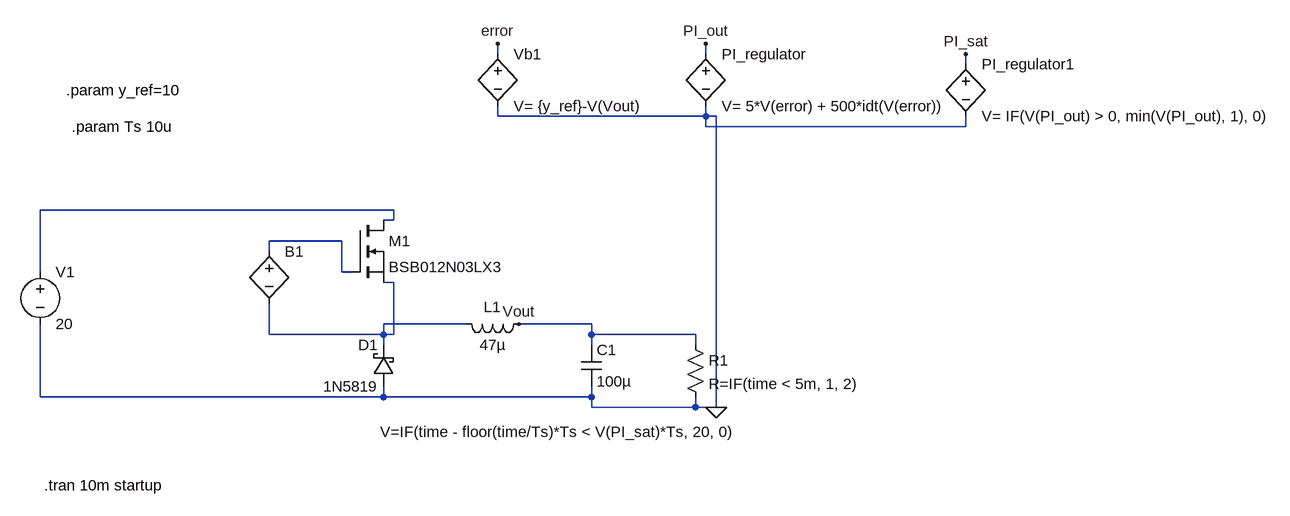
[diagram p0: schematic Buck-converter-closed-loop-control.asc]
Buck-converter-closed-loop-control.asc, the LTspice schematic file:
Version 4.1
SHEET 1 1948 680
WIRE 768 192 768 208
WIRE 448 192 448 208
WIRE 944 -240 944 -224
WIRE 1344 -224 1344 -208
WIRE 928 208 928 224
WIRE -80 96 -80 112
WIRE 624 -240 624 -224
WIRE 768 208 768 224
WIRE 768 224 928 224
WIRE 768 208 448 208
WIRE 928 224 960 224
WIRE 960 224 960 -224
WIRE 960 -224 944 -224
WIRE 944 -224 624 -224
WIRE 944 -224 944 -208
WIRE 944 -208 1344 -208
WIRE 448 208 -80 208
WIRE -80 208 -80 112
FLAG 960 224 0
WIRE 448 -64 464 -64
WIRE -80 16 -80 0
WIRE 464 -64 464 -80
WIRE 464 -80 -80 -80
WIRE -80 -80 -80 0
WIRE 272 -16 272 -32
WIRE 400 16 384 16
WIRE 272 -32 384 -32
WIRE 384 -32 384 16
WIRE 272 64 272 80
WIRE 448 128 448 112
WIRE 576 96 560 96
WIRE 448 32 464 32
WIRE 272 80 272 112
WIRE 272 112 448 112
WIRE 448 112 464 112
WIRE 464 112 464 32
WIRE 448 112 448 96
WIRE 448 96 560 96
WIRE 944 -320 944 -336
FLAG 944 -336 PI_out
WIRE 1344 -304 1344 -320
FLAG 1344 -320 PI_sat
WIRE 768 128 768 112
WIRE 656 96 672 96
WIRE 928 128 928 112
WIRE 768 112 768 96
WIRE 768 96 672 96
WIRE 768 112 928 112
FLAG 656 96 Vout
WIRE 624 -320 624 -336
FLAG 624 -336 error
SYMBOL voltage -80 0 R0
WINDOW 123 0 0 Left 0
WINDOW 39 0 0 Left 0
SYMATTR InstName V1
SYMATTR Value 20
SYMBOL ind 672 80 R90
WINDOW 0 5 56 VBottom 2
WINDOW 3 32 56 VTop 2
SYMATTR InstName L1
SYMATTR Value 47µ
SYMBOL schottky 464 192 R180
WINDOW 0 24 64 Left 2
WINDOW 3 24 0 Left 2
SYMATTR InstName D1
SYMATTR Value 1N5819
SYMATTR Description Diode
SYMATTR Type diode
SYMBOL cap 752 128 R0
SYMATTR InstName C1
SYMATTR Value 100µ
SYMBOL res 912 112 R0
SYMATTR InstName R1
SYMATTR Value R=IF(time < 5m, 1, 2)
SYMBOL nmos 400 -64 R0
SYMATTR InstName M1
SYMATTR Value BSB012N03LX3
SYMBOL bv 624 -336 R0
SYMATTR InstName Vb1
SYMATTR Value V= {y_ref}-V(Vout)
SYMBOL bv 944 -336 R0
SYMATTR InstName PI_regulator
SYMATTR Value V= 5*V(error) + 500*idt(V(error))
SYMBOL bv 1344 -320 R0
SYMATTR InstName PI_regulator1
SYMATTR Value V= IF(V(PI_out) > 0, min(V(PI_out), 1), 0)
SYMBOL bv 272 -32 R0
WINDOW 3 171 294 Left 2
SYMATTR InstName B1
SYMATTR Value V=IF(time - floor(time/Ts)*Ts < V(PI_sat)*Ts, 20, 0)
TEXT -74 344 Left 2 !.tran 10m startup
TEXT -40 -264 Left 2 !.param y_ref=10
TEXT -32 -208 Left 2 !.param Ts 10u

The netlist it stands for:
* Buck-converter-closed-loop-control.asc
V1 N001 0 20
L1 Vout N003 47µ
D1 0 N003 1N5819
C1 Vout 0 100µ
R1 Vout 0 R=IF(time < 5m, 1, 2)
M1 N001 N002 N003 N003 BSB012N03LX3
B§Vb1 error 0 V= {y_ref}-V(Vout)
B§PI_regulator PI_out 0 V= 5*V(error) + 500*idt(V(error))
B§PI_regulator1 PI_sat 0 V= IF(V(PI_out) > 0, min(V(PI_out), 1), 0)
B1 N002 N003 V=IF(time - floor(time/Ts)*Ts < V(PI_sat)*Ts, 20, 0)
.model D D
.lib standard.dio
.model NMOS NMOS
.model PMOS PMOS
.lib standard.mos
.tran 10m startup
.param y_ref=10
.param Ts 10u
.backanno
.end